# EAGLE schematic question_2 (EAGLE 8.2.2)
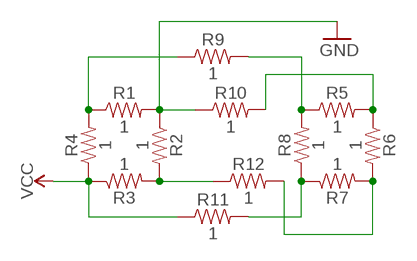
[diagram p0: schematic, sheet 1]

## Parts
R1  1  1OHM-0603-1/10W-1%  [0603]
R2  1  1OHM-0603-1/10W-1%  [0603]
R3  1  1OHM-0603-1/10W-1%  [0603]
R4  1  1OHM-0603-1/10W-1%  [0603]
R5  1  1OHM-0603-1/10W-1%  [0603]
R6  1  1OHM-0603-1/10W-1%  [0603]
R7  1  1OHM-0603-1/10W-1%  [0603]
R8  1  1OHM-0603-1/10W-1%  [0603]
R9  1  1OHM-0603-1/10W-1%  [0603]
R10  1  1OHM-0603-1/10W-1%  [0603]
R11  1  1OHM-0603-1/10W-1%  [0603]
R12  1  1OHM-0603-1/10W-1%  [0603]

## Nets
GND: R1.2 R2.1 R10.1
N$1: R1.1 R4.2 R9.1
N$3: R2.2 R3.2 R12.1
N$5: R6.2 R7.2 R12.2
N$6: R7.1 R8.1 R11.2
N$7: R5.1 R8.2 R9.2
N$8: R5.2 R6.1 R10.2
VCC: R3.1 R4.1 R11.1

## Library data of the parts
R1-R12 = SparkFun-Resistors:1OHM: 1Ω resistor A resistor is a passive two-terminal electrical component that implements electrical resistance as a circuit element. Resistors act to reduce current flow, and, at the same time, act to lower voltage levels within circuits. - Wikipedia; PROD_ID: RES-08269